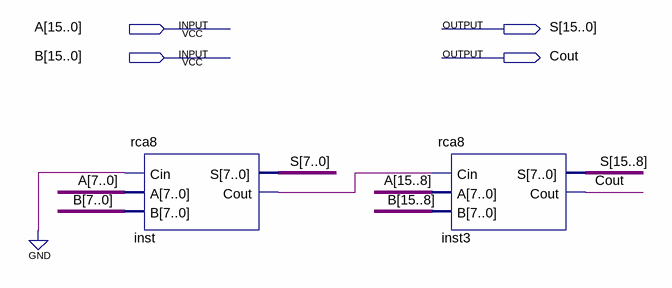
[diagram p0: schematic sheet]
// Quartus schematic rca16.bdf as structural Verilog: 2 symbols, 4 pins
module rca16 (
  input  [15:0] A,
  input  [15:0] B,
  output [15:0] S,
  output Cout
);

  wire inst_cout;

  rca8 inst (.Cin(1'b0), .A(A[7:0]), .B(B[7:0]), .S(S[7:0]), .Cout(inst_cout));
  rca8 inst3 (.Cin(inst_cout), .A(A[15:8]), .B(B[15:8]), .S(S[15:8]), .Cout(Cout));
endmodule
